# EAGLE design 2PLUS Osc Breakout Euro (EAGLE 7.7.0)
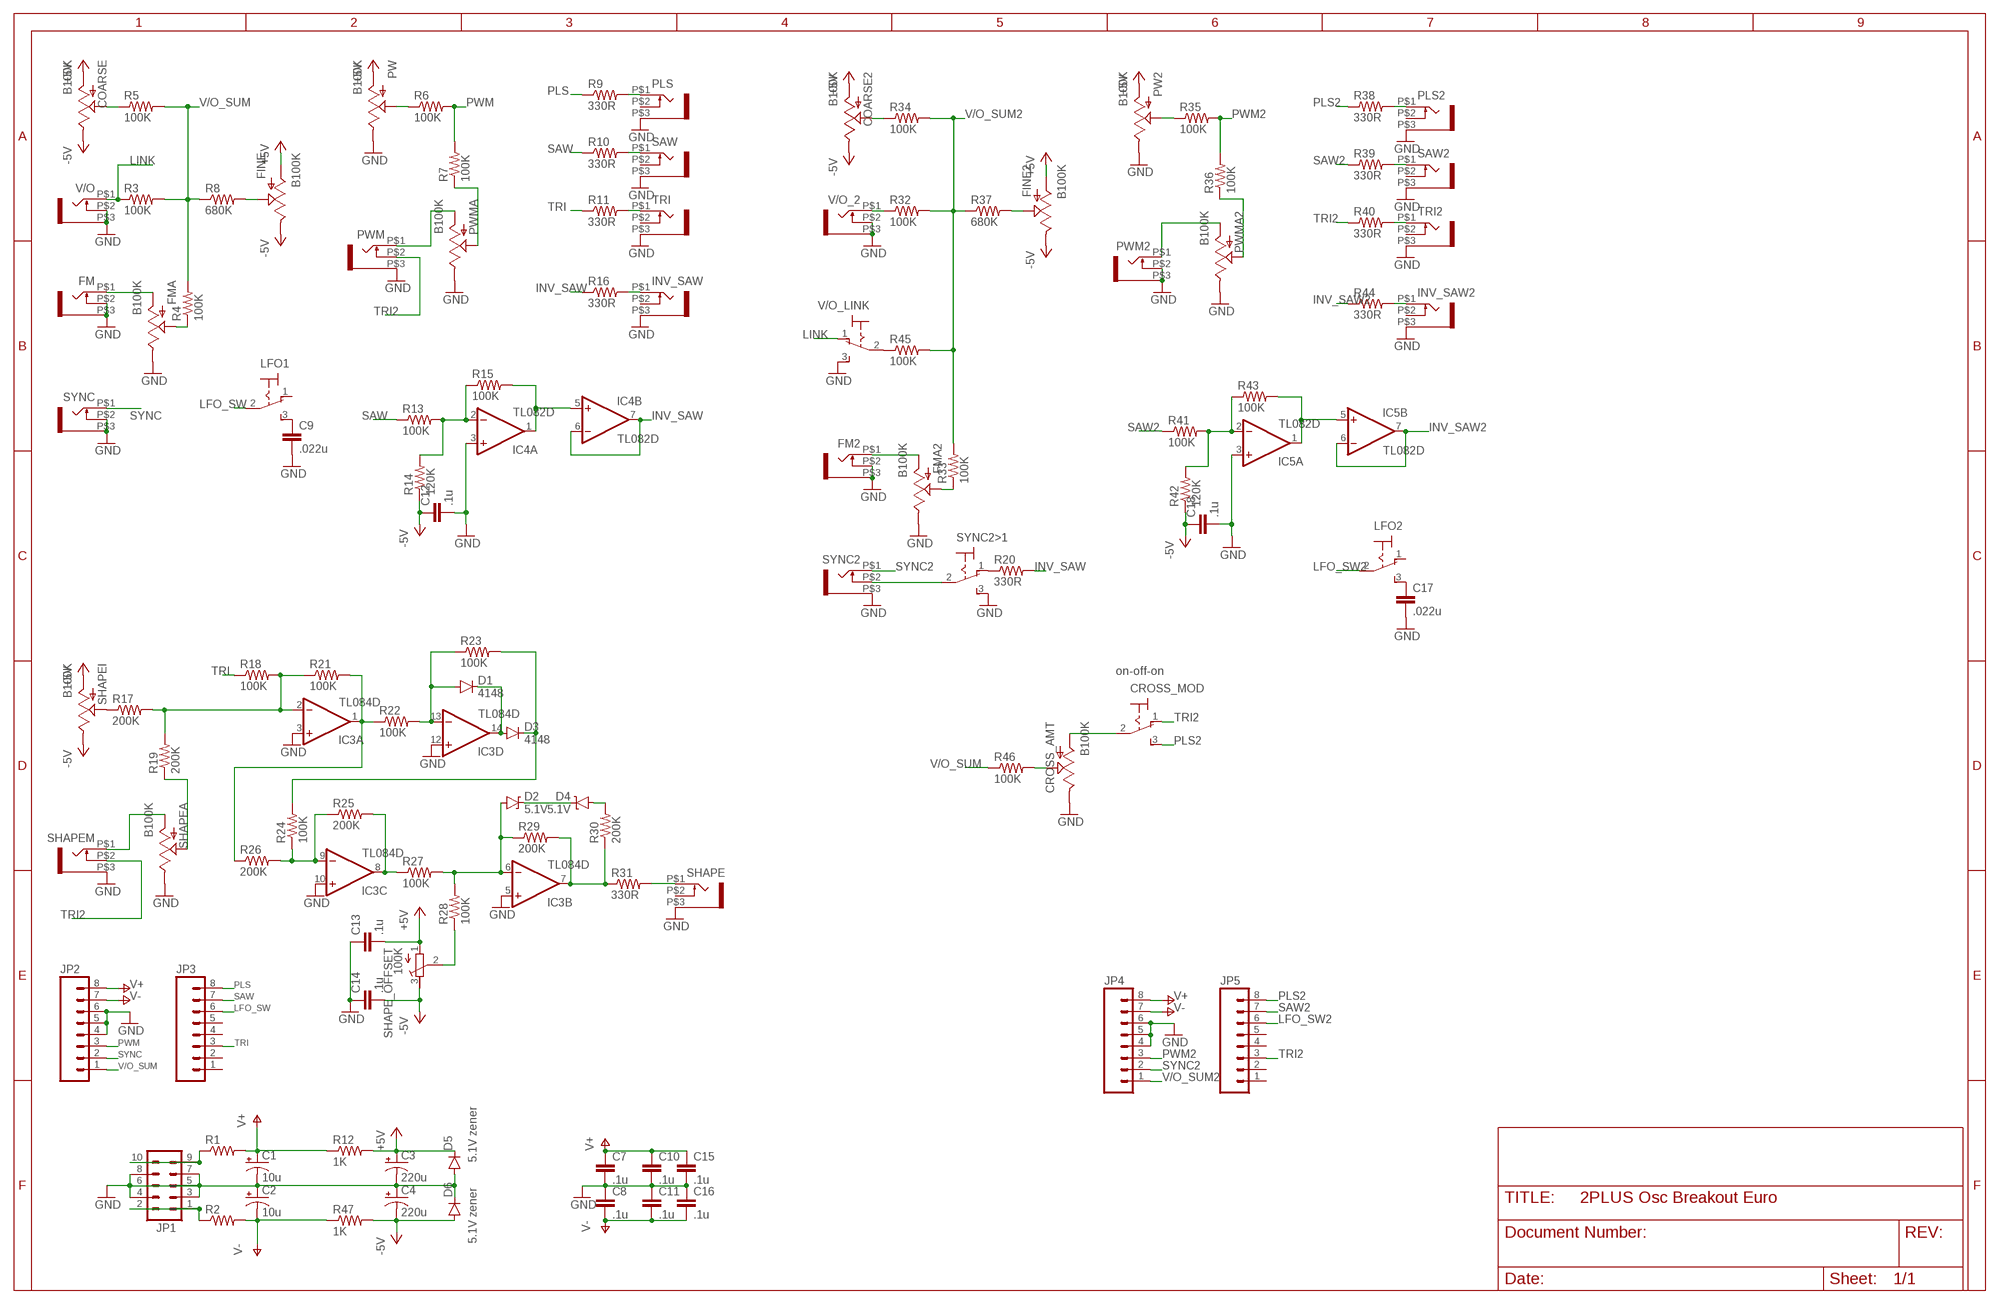
[diagram p0: schematic, sheet 1]

## Parts
C1  10u  CAP_POLC  [PANASONIC_C]
C2  10u  CAP_POLC  [PANASONIC_C]
C3  220u  CPOL-USE2.5-5  [E2,5-5]
C4  220u  CPOL-USE2.5-5  [E2,5-5]
C7  .1u  CAP0805  [0805]
C8  .1u  CAP0805  [0805]
C9  .022u  CAP0805  [0805]
C10  .1u  CAP0805  [0805]
C11  .1u  CAP0805  [0805]
C12  .1u  CAP0805  [0805]
C13  .1u  CAP0805  [0805]
C14  .1u  CAP0805  [0805]
C15  .1u  CAP0805  [0805]
C16  .1u  CAP0805  [0805]
C17  .022u  CAP0805  [0805]
C18  .1u  CAP0805  [0805]
COARSE  B100K  POT  [ALPS_POT]
COARSE2  B100K  POT  [ALPS_POT]
CROSS_AMT  B100K  POT  [ALPS_POT]
CROSS_MOD  M9040P  [M9040P]
D1  4148  DIODESOD123  [SOD-123]
D2  5.1V  DIODE-ZENER16V  [SOD-123]
D3  4148  DIODESOD123  [SOD-123]
D4  5.1V  DIODE-ZENER16V  [SOD-123]
D5  5.1V zener  DIODESOD123  [SOD-123]
D6  5.1V zener  DIODESOD123  [SOD-123]
FINE  B100K  POT  [ALPS_POT]
FINE2  B100K  POT  [ALPS_POT]
FM  WQP-PJ301M-12_JACK  [WQP-PJ301M-12_JACK]
FM2  WQP-PJ301M-12_JACK  [WQP-PJ301M-12_JACK]
FMA  B100K  POT  [ALPS_POT]
FMA2  B100K  POT  [ALPS_POT]
IC3  TL084D  [SO14]
IC4  TL082D  [SO08]
IC5  TL082D  [SO08]
INV_SAW  WQP-PJ301M-12_JACK  [WQP-PJ301M-12_JACK]
INV_SAW2  WQP-PJ301M-12_JACK  [WQP-PJ301M-12_JACK]
JP1  M05X2PTH  [AVR_ICSP]
JP2  M08  [1X08_ROUND]
JP3  M08  [1X08_ROUND]
JP4  M08  [1X08_ROUND]
JP5  M08  [1X08_ROUND]
LFO1  M9040P  [M9040P]
LFO2  M9040P  [M9040P]
PLS  WQP-PJ301M-12_JACK  [WQP-PJ301M-12_JACK]
PLS2  WQP-PJ301M-12_JACK  [WQP-PJ301M-12_JACK]
PW  B100K  POT  [ALPS_POT]
PW2  B100K  POT  [ALPS_POT]
PWM  WQP-PJ301M-12_JACK  [WQP-PJ301M-12_JACK]
PWM2  WQP-PJ301M-12_JACK  [WQP-PJ301M-12_JACK]
PWMA  B100K  POT  [ALPS_POT]
PWMA2  B100K  POT  [ALPS_POT]
R1  RESISTOR0805-RES  [0805]
R2  RESISTOR0805-RES  [0805]
R3  100K  RESISTOR0805-RES  [0805]
R4  100K  RESISTOR0805-RES  [0805]
R5  100K  RESISTOR0805-RES  [0805]
R6  100K  RESISTOR0805-RES  [0805]
R7  100K  RESISTOR0805-RES  [0805]
R8  680K  RESISTOR0805-RES  [0805]
R9  330R  RESISTOR0805-RES  [0805]
R10  330R  RESISTOR0805-RES  [0805]
R11  330R  RESISTOR0805-RES  [0805]
R12  1K  RESISTOR0805-RES  [0805]
R13  100K  RESISTOR0805-RES  [0805]
R14  120K  RESISTOR0805-RES  [0805]
R15  100K  RESISTOR0805-RES  [0805]
R16  330R  RESISTOR0805-RES  [0805]
R17  200K  RESISTOR0805-RES  [0805]
R18  100K  RESISTOR0805-RES  [0805]
R19  200K  RESISTOR0805-RES  [0805]
R20  330R  RESISTOR0805-RES  [0805]
R21  100K  RESISTOR0805-RES  [0805]
R22  100K  RESISTOR0805-RES  [0805]
R23  100K  RESISTOR0805-RES  [0805]
R24  100K  RESISTOR0805-RES  [0805]
R25  200K  RESISTOR0805-RES  [0805]
R26  200K  RESISTOR0805-RES  [0805]
R27  100K  RESISTOR0805-RES  [0805]
R28  100K  RESISTOR0805-RES  [0805]
R29  200K  RESISTOR0805-RES  [0805]
R30  200K  RESISTOR0805-RES  [0805]
R31  330R  RESISTOR0805-RES  [0805]
R32  100K  RESISTOR0805-RES  [0805]
R33  100K  RESISTOR0805-RES  [0805]
R34  100K  RESISTOR0805-RES  [0805]
R35  100K  RESISTOR0805-RES  [0805]
R36  100K  RESISTOR0805-RES  [0805]
R37  680K  RESISTOR0805-RES  [0805]
R38  330R  RESISTOR0805-RES  [0805]
R39  330R  RESISTOR0805-RES  [0805]
R40  330R  RESISTOR0805-RES  [0805]
R41  100K  RESISTOR0805-RES  [0805]
R42  120K  RESISTOR0805-RES  [0805]
R43  100K  RESISTOR0805-RES  [0805]
R44  330R  RESISTOR0805-RES  [0805]
R45  100K  RESISTOR0805-RES  [0805]
R46  100K  RESISTOR0805-RES  [0805]
R47  1K  RESISTOR0805-RES  [0805]
SAW  WQP-PJ301M-12_JACK  [WQP-PJ301M-12_JACK]
SAW2  WQP-PJ301M-12_JACK  [WQP-PJ301M-12_JACK]
SHAPE  WQP-PJ301M-12_JACK  [WQP-PJ301M-12_JACK]
SHAPE_OFFSET  100K  R-TRIMM3296Y  [RTRIM3296Y]
SHAPEA  B100K  POT  [ALPS_POT]
SHAPEI  B100K  POT  [ALPS_POT]
SHAPEM  WQP-PJ301M-12_JACK  [WQP-PJ301M-12_JACK]
SYNC  WQP-PJ301M-12_JACK  [WQP-PJ301M-12_JACK]
SYNC2  WQP-PJ301M-12_JACK  [WQP-PJ301M-12_JACK]
SYNC2>1  M9040P  [M9040P]
TRI  WQP-PJ301M-12_JACK  [WQP-PJ301M-12_JACK]
TRI2  WQP-PJ301M-12_JACK  [WQP-PJ301M-12_JACK]
V/O  WQP-PJ301M-12_JACK  [WQP-PJ301M-12_JACK]
V/O_2  WQP-PJ301M-12_JACK  [WQP-PJ301M-12_JACK]
V/O_LINK  M9040P  [M9040P]

## Nets
+5V: C3.+ C13.2 COARSE2.P$3(A) COARSE.P$3(A) D5.C FINE2.P$3(A) FINE.P$3(A) PW2.P$3(A) PW.P$3(A) R12.2 SHAPE_OFFSET.1(A) SHAPEI.P$3(A)
-5V: C4.- C12.1 C14.2 C18.1 COARSE2.P$1(E) COARSE.P$1(E) D6.A FINE2.P$1(E) FINE.P$1(E) R14.1 R42.1 R47.2 SHAPE_OFFSET.3(E) SHAPEI.P$1(E)
GND: C1.- C2.+ C3.- C4.+ C7.2 C8.1 C9.2 C10.2 C11.1 C12.2 C13.1 C14.1 C15.2 C16.1 C17.2 C18.2 CROSS_AMT.P$1(E) D5.A D6.C FM2.P$2 FM2.P$3 FM.P$2 FM.P$3 FMA2.P$1(E) FMA.P$1(E) IC3.3(A:+IN) IC3.5(B:+IN) IC3.10(C:+IN) IC3.12(D:+IN) IC4.3(A:+IN) IC5.3(A:+IN) INV_SAW2.P$3 INV_SAW.P$3 JP1.3 JP1.4 JP1.5 JP1.6 JP1.7 JP1.8 JP2.4 JP2.5 JP2.6 JP4.4 JP4.5 JP4.6 PLS2.P$3 PLS.P$3 PW2.P$1(E) PW.P$1(E) PWM2.P$2 PWM2.P$3 PWM.P$3 PWMA2.P$1(E) PWMA.P$1(E) SAW2.P$3 SAW.P$3 SHAPE.P$3 SHAPEA.P$1(E) SHAPEM.P$3 SYNC2.P$3 SYNC2>1.3(S) SYNC.P$2 SYNC.P$3 TRI2.P$3 TRI.P$3 V/O.P$2 V/O.P$3 V/O_2.P$2 V/O_2.P$3 V/O_LINK.3(S)
INV_SAW: IC4.6(B:-IN) IC4.7(B:OUT) R16.1 R20.2
INV_SAW2: IC5.6(B:-IN) IC5.7(B:OUT) R44.1
LFO_SW: JP3.6 LFO1.2(P)
LFO_SW2: JP5.6 LFO2.2(P)
LINK: R3.1 V/O.P$1 V/O_LINK.1(O)
N$1: JP1.9 JP1.10 R1.1
N$2: JP1.1 JP1.2 R2.1
N$3: FM.P$1 FMA.P$3(A)
N$4: COARSE.P$2(S) R5.1
N$5: R45.1 V/O_LINK.2(P)
N$6: FMA.P$2(S) R4.1
N$7: PW.P$2(S) R6.1
N$8: PWM.P$1 PWMA.P$3(A)
N$9: FINE.P$2(S) R8.2
N$10: C9.1 LFO1.3(S)
N$11: PWMA.P$2(S) R7.1
N$12: PLS.P$1 R9.2
N$13: R10.2 SAW.P$1
N$14: R11.2 TRI.P$1
N$15: IC4.2(A:-IN) R13.2 R14.2 R15.1
N$16: IC3.2(A:-IN) R17.2 R18.2 R19.2 R21.1
N$17: IC4.1(A:OUT) IC4.5(B:+IN) R15.2
N$18: CROSS_AMT.P$2(S) R46.2
N$19: INV_SAW.P$1 R16.2
N$20: R17.1 SHAPEI.P$2(S)
N$21: SHAPEA.P$3(A) SHAPEM.P$1
N$22: R19.1 SHAPEA.P$2(S)
N$23: SYNC2.P$2 SYNC2>1.2(P)
N$24: IC3.1(A:OUT) R21.2 R22.1 R26.1
N$25: D1.C D3.A IC3.14(D:OUT)
N$26: D1.A IC3.13(D:-IN) R22.2 R23.1
N$27: D3.C R23.2 R24.2
N$28: IC3.9(C:-IN) R24.1 R25.1 R26.2
N$29: IC3.8(C:OUT) R25.2 R27.1
N$30: D2.A IC3.6(B:-IN) R27.2 R28.2 R29.1
N$31: R28.1 SHAPE_OFFSET.2(S)
N$32: D2.C D4.C
N$33: D4.A R30.2
N$34: IC3.7(B:OUT) R29.2 R30.1 R31.1
N$35: R31.2 SHAPE.P$1
N$36: COARSE2.P$2(S) R34.1
N$37: R32.1 V/O_2.P$1
N$38: CROSS_AMT.P$3(A) CROSS_MOD.2(P)
N$39: FMA2.P$2(S) R33.1
N$40: C17.1 LFO2.3(S)
N$41: PW2.P$2(S) R35.1
N$42: FINE2.P$2(S) R37.2
N$43: PLS2.P$1 R38.2
N$44: R39.2 SAW2.P$1
N$45: R40.2 TRI2.P$1
N$46: FM2.P$1 FMA2.P$3(A)
N$47: PWM2.P$1 PWMA2.P$3(A)
N$48: INV_SAW2.P$1 R44.2
N$49: PWMA2.P$2(S) R36.1
N$50: R20.1 SYNC2>1.1(O)
N$61: IC5.2(A:-IN) R41.2 R42.2 R43.1
N$62: IC5.1(A:OUT) IC5.5(B:+IN) R43.2
PLS: JP3.8 R9.1
PLS2: CROSS_MOD.3(S) JP5.8 R38.1
PWM: JP2.3 R6.2 R7.2
PWM2: JP4.3 R35.2 R36.2
SAW: JP3.7 R10.1 R13.1
SAW2: JP5.7 R39.1 R41.1
SYNC: JP2.2 SYNC.P$1
SYNC2: JP4.2 SYNC2.P$1
TRI: JP3.3 R11.1 R18.1
TRI2: CROSS_MOD.1(O) JP5.3 PWM.P$2 R40.1 SHAPEM.P$2
V+: C1.+ C7.1 C10.1 C15.1 JP2.8 JP4.8 R1.2 R12.1
V-: C2.- C8.2 C11.2 C16.2 JP2.7 JP4.7 R2.2 R47.1
V/O_SUM: JP2.1 R3.2 R4.2 R5.2 R8.1 R46.1
V/O_SUM2: JP4.1 R32.2 R33.2 R34.2 R37.1 R45.2
Unconnected: INV_SAW2.P$2 INV_SAW.P$2 JP3.1 JP3.2 JP3.4 JP3.5 JP5.1 JP5.2 JP5.4 JP5.5 LFO1.1(O) LFO2.1(O) PLS2.P$2 PLS.P$2 SAW2.P$2 SAW.P$2 SHAPE.P$2 TRI2.P$2 TRI.P$2

## Notes on the sheet
- on-off-on

## Power pins joined to a net without a drawn wire
V+: IC3.4(P:V+) IC4.8(P:V+) IC5.8(P:V+)
V-: IC3.11(P:V-) IC4.4(P:V-) IC5.4(P:V-)

## Library data of the parts
C1 C2 = SparkFun-Capacitors:CAP_POL: Capacitor Polarized These are standard SMD and PTH capacitors. Normally 10uF, 47uF, and 100uF in electrolytic and tantalum varieties. Always verify the external diameter of the through hole cap, it varies with capacity, voltage, and manufacturer. The EIA devices should be standard.
C3 C4 = rcl:CPOL-US: POLARIZED CAPACITOR, American symbol
C7-C18 = SparkFun-Capacitors:CAP: Capacitor Standard 0603 ceramic capacitor, and 0.1" leaded capacitor.
COARSE COARSE2 CROSS_AMT FINE FINE2 FMA FMA2 PW PW2 PWMA PWMA2 SHAPEA SHAPEI = SparkFun-Electromechanical:POT; PROD_ID: RES-09177
CROSS_MOD LFO1 LFO2 SYNC2>1 V/O_LINK = switch:M9040P: TOGGLE SWITCH Marquardt
D1 D3 D5 D6 = SparkFun-DiscreteSemi:DIODE: Diode These are standard reverse protection diodes and small signal diodes. SMA package can handle up to about 1A. SOD-323 can handle about 200mA. What the SOD-323 package when ordering, there are some mfgs out there that are 5-pin packages.
D2 D4 = SparkFun-DiscreteSemi:DIODE-ZENER: Zener Diode Production Part - 8199 3.4V Zener Voltage; PROD_ID: DIO-12440; VALUE: 16V
FM FM2 INV_SAW INV_SAW2 PLS PLS2 PWM PWM2 SAW SAW2 SHAPE SHAPEM SYNC SYNC2 TRI TRI2 V/O V/O_2 = thonkiconn:WQP-PJ301M-12_JACK
IC3 = linear:TL084: OP AMP
IC4 IC5 = linear:TL082: OP AMP Data sheet <http://www.ti.com/lit/ds/symlink/tl084a . pdf>; DATA_SHEET: <a href="http://www.ti.com/lit/ds/symlink/tl084a.pdf"> Data sheet </a>
JP1 = SparkFun-Connectors:M05X2: Header 5x2 Standard 10-pin dual row 0.1" header. Commonly used with AVR-ISP. Use with Spark Fun Electronics SKU: PRT-00778
JP2-JP5 = SparkFun-Connectors:M08: Header 8 Standard 8-pin 0.1" header. Use with straight break away headers (SKU : PRT-00116), right angle break away headers (PRT-00553), swiss pins (PRT-00743), machine pins (PRT-00117), and female headers (PRT-00115).
R1-R47 = SparkFun-Passives:RESISTOR: Resistor Basic schematic elements and footprints for 0603, 1206, and PTH resistors.
SHAPE_OFFSET = rcl:R-TRIMM: Trimm resistor

## Board
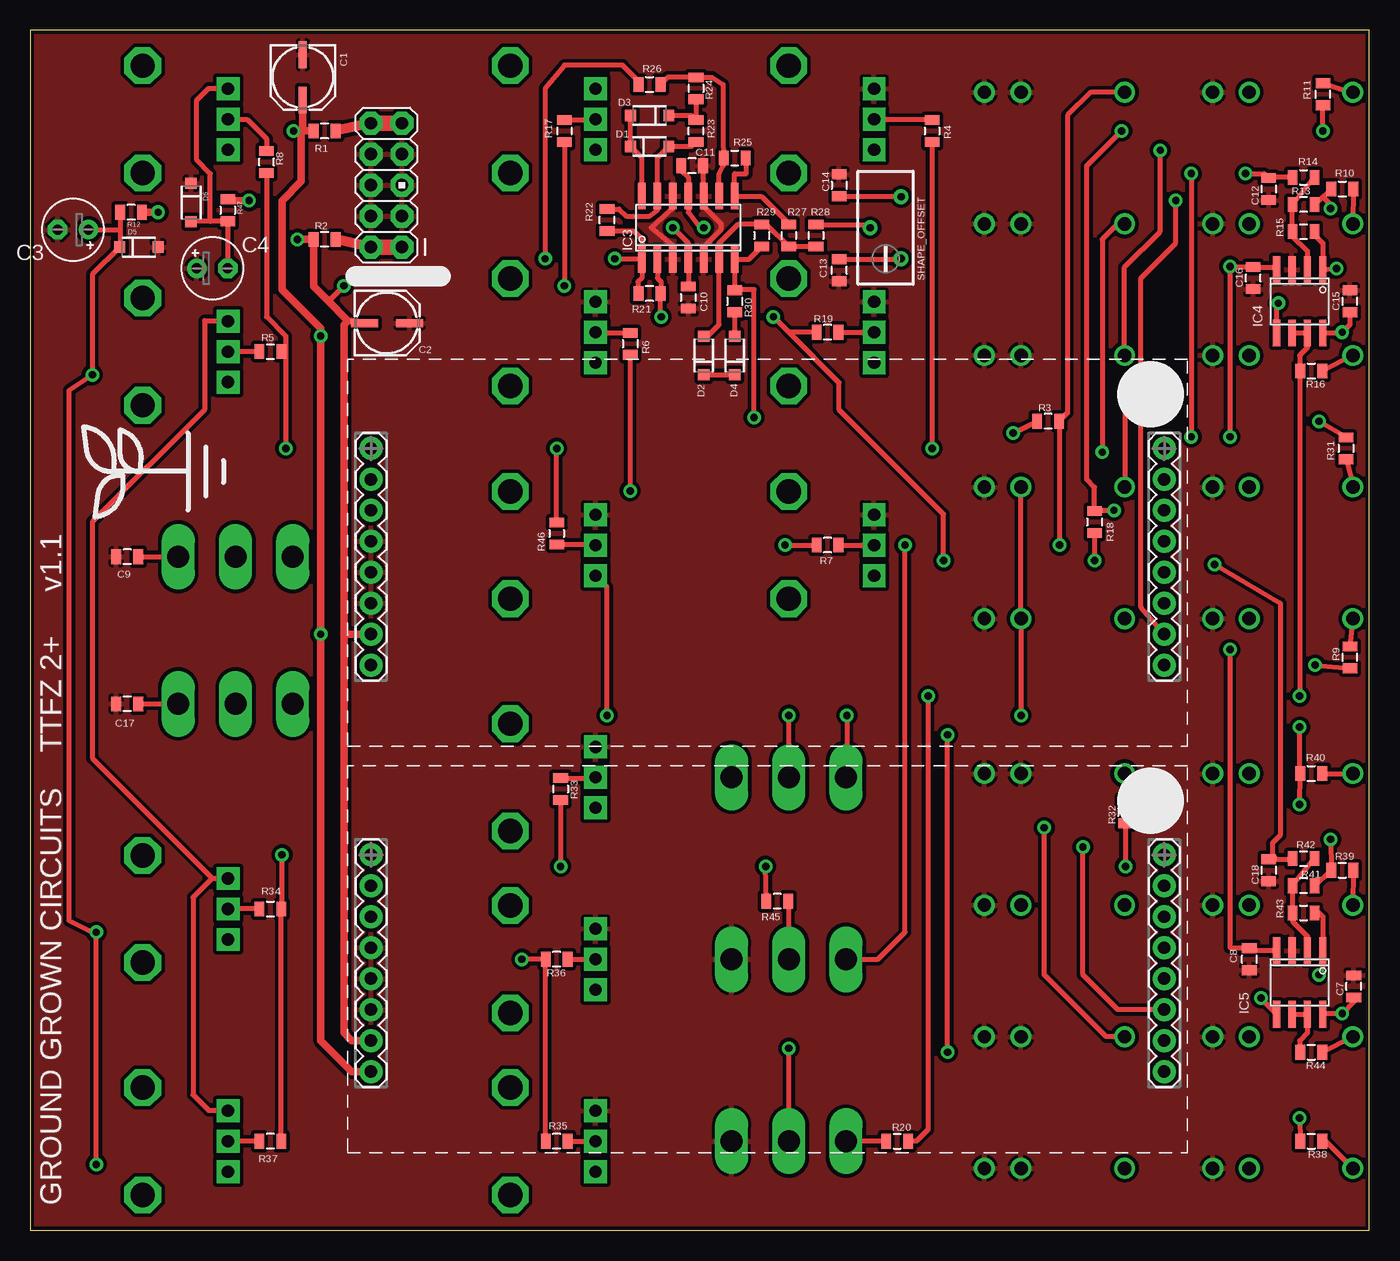
[diagram p1: board, top side]
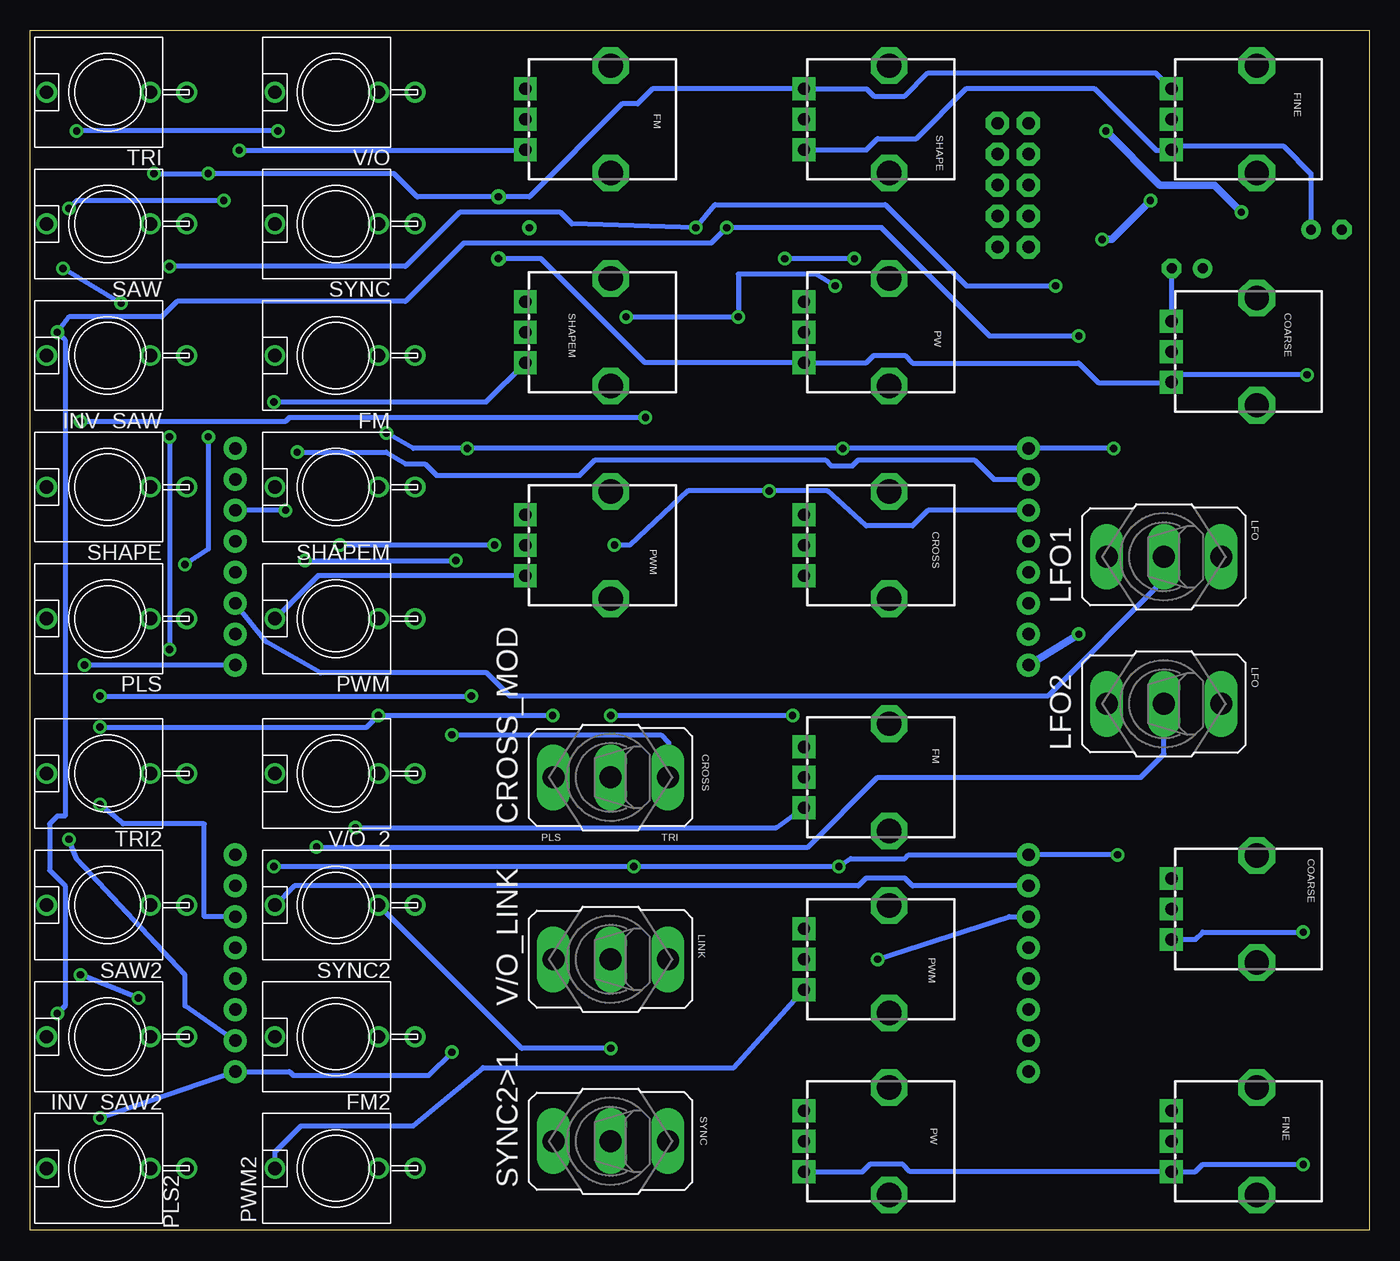
[diagram p2: board, bottom side, seen from below]

Size 109.83 x 98.41 mm. Coordinates in mm from the lower left corner, seen from the top.
Outline: 0,0 109.83,0 109.83,98.41 0,98.41 0,0
Copper layers (1*16): Top 0.035mm / dielectric 1.5mm / Bottom 0.035mm
Design rules "SparkFun": minimum track width 8mil, minimum drill 20mil, track to track 8mil, track to pad 8mil, pad to pad 8mil, via to via 8mil, smd to smd 8mil, copper to edge 8mil, drill to drill 8mil, minimum pad ring 12mil, minimum via ring 10mil, stop-mask expansion 4mil, vias tented up to drill 20mil, thermal gap 10mil

### Footprints (pad centres in the part's own frame; a part is rotated, then mirrored left to right if it is on the bottom)
PANASONIC_C = smd 2.2 x 0.65: + 1.9,-0.2; - -1.8,-0.2
E2,5-5 = drill 0.813 pad 1.6: + -1.27,0 | drill 0.813 pad 1.6 octagon: - 1.27,0
0805 = smd 0.8 x 1.2: 1 -0.9,0; 2 0.9,0
ALPS_POT = drill 1 pad 1.88 square: P$1 7,-2.5; P$2 7,0; P$3 7,2.5 | drill 2 octagon: P$4 0,-4.4; P$5 0,4.4
M9040P = drill 1.803 long: 1 0,4.699; 2 0,0; 3 0,-4.699
SOD-123 = smd 0.9 x 0.95: A 1.575,0; C -1.575,0
WQP-PJ301M-12_JACK = drill 1.1: P$1 0,5; P$2 0,-3.5; P$3 0,-6.5
SO14 = smd 0.6 x 2.2: 1 -3.81,-2.6; 2 -2.54,-2.6; 3 -1.27,-2.6; 4 0,-2.6; 5 1.27,-2.6; 6 2.54,-2.6; 7 3.81,-2.6; 8 3.81,2.6; 9 2.54,2.6; 10 1.27,2.6; 11 0,2.6; 12 -1.27,2.6; 13 -2.54,2.6; 14 -3.81,2.6
SO08 = smd 0.6 x 2.2: 1 -1.905,-2.6; 2 -0.635,-2.6; 3 0.635,-2.6; 4 1.905,-2.6; 5 1.905,2.6; 6 0.635,2.6; 7 -0.635,2.6; 8 -1.905,2.6
AVR_ICSP = drill 1.016 pad 1.88 octagon: 1 -1.27,5.08; 2 1.27,5.08; 3 -1.27,2.54; 4 1.27,2.54; 5 -1.27,0; 6 1.27,0; 7 -1.27,-2.54; 8 1.27,-2.54; 9 -1.27,-5.08; 10 1.27,-5.08
1X08_ROUND = drill 1.016 pad 1.88: 1 0,0; 2 2.54,0; 3 5.08,0; 4 7.62,0; 5 10.16,0; 6 12.7,0; 7 15.24,0; 8 17.78,0
RTRIM3296Y = drill 0.61: 1 1.27,-2.54; 2 -1.27,0; 3 1.27,2.54

### Placement (x,y rotation side)
C1  22.54,94.61 270 top
C2  29.21,74.61 0 top
C3  3.49,82.07 180 top
C4  14.92,78.9 0 top
C7  108.58,20 90 top
C8  100.01,22.23 90 top
C9  7.94,55.24 180 top
C10  53.98,76.52 270 top
C11  54.29,87.31 180 top
C12  101.6,85.41 270 top
C13  66.36,78.74 90 top
C14  66.36,85.72 270 top
C15  108.27,76.2 90 top
C16  100.33,78.11 90 top
C17  7.94,43.18 180 top
C18  101.6,29.53 270 top
COARSE  9.21,72.07 180 bottom
COARSE2  9.21,26.35 180 bottom
CROSS_AMT  39.37,56.2 180 bottom
CROSS_MOD  62.23,37.15 90 bottom
D1  50.8,88.9 0 top
D2  55.24,71.75 90 top
D3  50.8,91.44 180 top
D4  57.78,71.75 90 top
D5  8.89,80.64 0 top
D6  13.18,84.3 270 top
FINE  9.21,91.12 180 bottom
FINE2  9.21,7.3 180 bottom
FM  84.77,71.75 90 bottom
FM2  84.77,15.88 90 bottom
FMA  62.23,91.12 180 bottom
FMA2  39.37,37.15 180 bottom
IC3  53.98,82.23 0 top
IC4  104.14,76.2 180 top
IC5  104.14,20.32 180 top
INV_SAW  103.5,71.75 90 bottom
INV_SAW2  103.5,15.88 90 bottom
JP1  29.21,85.72 180 top
JP2  27.94,64.14 270 top
JP3  93.03,64.14 270 top
JP4  27.94,30.8 270 top
JP5  93.03,30.8 270 top
LFO1  16.83,55.24 90 bottom
LFO2  16.83,43.18 90 bottom
PLS  103.5,50.16 90 bottom
PLS2  103.5,5.08 90 bottom
PW  39.37,73.66 180 bottom
PW2  39.37,7.3 180 bottom
PWM  84.77,50.16 90 bottom
PWM2  84.77,5.08 90 bottom
PWMA  62.23,56.2 180 bottom
PWMA2  39.37,22.23 180 bottom
R1  24.13,90.17 180 top
R2  24.13,81.28 180 top
R3  83.5,66.36 180 top
R4  73.98,90.17 270 top
R5  19.68,72.07 0 top
R6  49.21,72.71 270 top
R7  65.41,56.2 180 top
R8  19.37,87.63 90 top
R9  108.27,46.99 90 top
R10  107.63,85.41 0 top
R11  106.05,93.19 90 top
R12  8.26,83.5 180 top
R13  104.46,84.14 180 top
R14  104.46,86.36 0 top
R15  104.46,81.92 0 top
R16  105.09,70.48 0 top
R17  43.81,90.17 270 top
R18  87.31,58.1 270 top
R19  65.41,73.66 180 top
R20  71.12,7.3 0 top
R21  50.8,76.83 180 top
R22  47.31,82.87 90 top
R23  54.61,90.17 90 top
R24  54.61,93.66 270 top
R25  57.78,87.95 0 top
R26  50.8,93.98 0 top
R27  62.23,81.6 270 top
R28  64.45,81.6 270 top
R29  60.01,81.6 270 top
R30  57.78,76.2 270 top
R31  107.95,64.14 270 top
R32  89.85,34.29 270 top
R33  43.5,36.2 270 top
R34  19.68,26.35 0 top
R35  43.18,7.3 180 top
R36  43.18,22.23 180 top
R37  19.68,7.3 180 top
R38  105.09,7.3 0 top
R39  107.63,29.53 0 top
R40  105.09,37.47 0 top
R41  104.46,28.26 180 top
R42  104.46,30.48 0 top
R43  104.46,26.04 0 top
R44  105.09,14.61 0 top
R45  61.28,26.99 180 top
R46  43.18,57.15 270 top
R47  16.19,83.66 270 top
SAW  103.5,82.55 90 bottom
SAW2  103.5,26.67 90 bottom
SHAPE  103.5,60.96 90 bottom
SHAPE_OFFSET  70.17,82.23 0 top
SHAPEA  62.23,73.66 180 bottom
SHAPEI  39.37,91.12 180 bottom
SHAPEM  84.77,60.96 90 bottom
SYNC  84.77,82.55 90 bottom
SYNC2  84.77,26.67 90 bottom
SYNC2>1  62.23,7.3 90 bottom
TRI  103.5,93.34 90 bottom
TRI2  103.5,37.47 90 bottom
U$1  [OSC_CORE_OUTLINE]  26.04,39.69 0 top
U$2  [OSC_CORE_OUTLINE]  26.04,6.35 0 top
U$3  [LOGO_MED]  12.86,62.23 90 top
V/O  84.77,93.34 90 bottom
V/O_2  84.77,37.47 90 bottom
V/O_LINK  62.23,22.23 90 bottom

### Tracks (layer width: path | path; a pad name or v marks a point on that pad's centre or on a via)
+5V  (via drill 0.6)
  Top 0.406: v5.4,5.4 v5.4,24.45 5.08,24.45 3.17,25.4 3.17,68.9 v5.08,70.17 5.08,78.41 D5.C 7.36,80.69 7.36,82.07 | C13.2 71.39,79.64 SHAPE_OFFSET.1 | R12.2 7.36,82.07 | C3.+ 7.36,82.07
  Bottom 0.406: v5.08,70.17 15.61,70.17 COARSE.P$3 16.25,69.53 22.23,69.53 23.81,71.12 37.47,71.12 38.1,71.75 40.64,71.75 41.23,71.16 PW.P$3 59.41,71.16 67.94,79.69 SHAPE_OFFSET.1 | COARSE2.P$3 14.25,23.85 13.65,24.45 v5.4,24.45 | v5.4,5.4 13.65,5.4 14.25,4.8 FINE2.P$3 37.66,4.8 38.26,5.4 40.96,5.4 41.59,4.76 46.65,4.76 PW2.P$3 | SHAPEI.P$3 41.23,88.62 40.32,89.53 37.15,89.53 33.02,93.66 22.54,93.66 17.46,88.58 16.25,88.58 FINE.P$3 15.93,88.9 6.99,88.9 4.76,86.68 C3.+
-5V  (via drill 0.6)
  Top 0.406: FINE.P$1 16.17,93.66 14.61,93.66 13.65,92.71 13.65,87.79 14.76,86.68 14.76,82.76 | 14.29,74.61 16.17,74.61 COARSE.P$1 14.33,74.57 14.29,74.61 | 14.29,74.61 14.29,67.31 5.08,58.1 5.08,38.73 14.92,28.89 16.17,28.89 COARSE2.P$1 14.88,28.85 13.34,27.3 13.34,11.11 14.61,9.84 16.17,9.84 FINE2.P$1 | C18.1 102.23,30.43 | 102.23,30.43 103.5,30.43 R42.1 | C14.2 71.39,84.83 SHAPE_OFFSET.3 | v99.69,86.68 101.23,86.68 C12.1 101.65,86.36 R14.1 | v95.25,86.68 v95.25,65.09 | v97.16,54.61 102.55,51.44 102.55,32.38 101.92,31.75 101.92,30.75 102.23,30.43 | C4.- R47.2 14.76,82.76 | 14.76,82.76 13.22,82.76 D6.A
  Bottom 0.406: FINE.P$1 17.52,94.93 36.2,94.93 38.1,93.03 40.64,93.03 41.23,93.62 SHAPEI.P$1 58.78,93.62 60.01,92.39 61.28,92.39 68.9,84.77 SHAPE_OFFSET.3 78.11,84.77 80.01,86.68 v95.25,86.68 v99.69,86.68 | v95.25,65.09 95.25,55.88 v97.16,54.61 | C4.- 16.17,78.87 16.21,78.83 COARSE.P$1
GND
  Top 0.406: C11.1 55.19,84.89 | 55.19,84.89 IC3.10 | 55.19,84.89 55.19,84.03 56.67,82.55 56.67,82.07 55.24,80.64 IC3.5 | IC3.12 52.7,83.82 50.96,82.23 52.7,80.8 IC3.3
  pour Top (isolate 0.305): 0,0 0,98.42 109.86,98.42 109.86,0
INV_SAW  (via drill 0.6)
  Top 0.406: IC4.6 IC4.7 104.78,72.39 104.14,71.75 104.14,70.54 R16.1 104.14,70.48 v104.14,43.81 | v73.66,43.81 73.66,8.26 72.71,7.3 R20.2
  Bottom 0.406: v104.14,43.81 v73.66,43.81
INV_SAW2
  Top 0.406: IC5.6 IC5.7 104.78,16.19 104.14,15.56 104.14,14.66 R44.1
LFO_SW
  Bottom 0.406: LFO1.2 16.83,53.34 26.35,43.81 70.48,43.81 72.39,45.72 86.04,45.72 90.49,48.26 JP3.6
LFO_SW2  (via drill 0.6)
  Top 0.406: JP5.6 89.22,18.1 86.36,20.95 v86.36,31.43
  Bottom 0.406: v86.36,31.43 46.04,31.43 40.32,37.15 18.73,37.15 16.83,39.05 LFO2.2
LINK  (via drill 0.6)
  Top 0.406: V/O.P$1 87,93.34 85.09,91.44 85.09,67.05 R3.1 84.45,66.31 v84.45,56.2 | V/O_LINK.1 69.53,22.23 71.75,24.45 v71.75,56.2
  Bottom 0.406: v71.75,56.2 v84.45,56.2
N$1
  Top 0.813: JP1.10 R1.1
  Top 1.27: JP1.9 JP1.10
N$2
  Top 0.813: JP1.2 R2.1
  Top 1.27: JP1.2 JP1.1
N$3  (via drill 0.6)
  Top 0.406: FM.P$1 89.77,78.98 92.71,81.92 v92.71,88.58
  Bottom 0.406: v92.71,88.58 69.27,88.58 FMA.P$3
N$4
  Top 0.406: R5.1 COARSE.P$2
N$5
  Top 0.406: R45.1 V/O_LINK.2
N$6
  Top 0.406: R4.1 69.23,91.07 FMA.P$2
N$7
  Top 0.406: PW.P$2 46.32,73.61 R6.1
N$8
  Bottom 0.406: PWMA.P$3 86.24,53.7 PWM.P$1
N$9
  Top 0.406: FINE.P$2 17.78,91.12 19.37,89.53 R8.2
N$10
  Top 0.406: C9.1 LFO1.3
N$11
  Top 0.406: R7.1 PWMA.P$2
N$12
  Top 0.406: PLS.P$1 R9.2
N$13
  Top 0.406: R10.2 SAW.P$1
N$14
  Top 0.406: R11.2 108.45,93.29 TRI.P$1
N$15
  Top 0.406: IC4.2 104.78,80.33 103.56,81.55 R15.1 R13.2 R14.2
N$16  (via drill 0.6)
  Top 0.406: IC3.2 51.44,78.11 51.75,77.79 51.75,76.89 R21.1 51.7,74.93 v51.75,74.93 | R17.2 v43.81,77.47 | R19.2 62.23,73.66 | 62.23,73.66 62.07,73.82 v60.96,74.93 | R18.2 v87.31,54.93 | v74.93,54.93 74.93,58.74 66.36,67.31 66.36,69.53 62.23,73.66
  Bottom 0.406: v43.81,77.47 45.4,78.42 51.75,78.42 v51.75,74.93 v60.96,74.93 | v87.31,54.93 v74.93,54.93
N$17  (via drill 0.6)
  Top 0.406: R15.2 105.36,81.65 106.05,80.96 IC4.1 v107.16,78.9 | v102.39,76.04 102.23,75.88 IC4.5
  Bottom 0.406: v107.16,78.9 v102.39,76.04
N$18
  Top 0.406: R46.2 46.32,56.25 CROSS_AMT.P$2
N$19
  Top 0.406: R16.2 INV_SAW.P$1
N$20
  Top 0.406: R17.1 46.32,91.07 SHAPEI.P$2
N$21  (via drill 0.6)
  Top 0.406: SHAPEM.P$1 89.85,61.04 v89.85,67.94
  Bottom 0.406: v89.85,67.94 72.44,67.94 SHAPEA.P$3
N$22
  Top 0.406: R19.1 SHAPEA.P$2
N$23  (via drill 0.6)
  Top 0.406: SYNC2>1.2 v62.23,14.92
  Bottom 0.406: v62.23,14.92 69.53,14.92 SYNC2.P$2
N$24  (via drill 0.6)
  Top 0.406: R22.1 49.48,81.97 50.16,81.28 IC3.1 | IC3.1 50.16,78.11 49.85,77.79 49.85,76.89 R21.2 | R26.1 49.9,94.25 48.58,95.57 43.81,95.57 42.23,93.66 v42.23,79.69 | v47.94,79.69 50.1,79.69 IC3.1
  Bottom 0.406: v42.23,79.69 v47.94,79.69
N$25
  Top 0.406: IC3.14 50.16,87.96 D1.C D3.A
N$26
  Top 0.406: R23.1 54.24,88.9 D1.A 51.44,87.96 IC3.13 51.44,83.66 50.8,83.19 48.9,83.19 48.31,83.77 R22.2
N$27
  Top 0.406: D3.C 54.24,91.44 R23.2 R24.2
N$28
  Top 0.406: R26.2 52.28,94.56 R24.1 55.93,94.56 56.83,93.98 56.83,89.59 R25.1 56.83,87.89 56.83,87.31 56.52,86.68 IC3.9
N$29
  Top 0.406: R25.2 58.74,87.58 58.74,86.68 57.78,86.68 IC3.8 57.84,84.77 60.01,84.77 62.23,82.55 R27.1
N$30
  Top 0.406: R28.2 R27.2 60.43,82.5 R29.1 59.95,82.55 58.1,82.55 56.52,80.96 IC3.6 56.52,74.3 55.55,73.33 D2.A
N$31
  Top 0.406: R28.1 68.63,82.5 SHAPE_OFFSET.2
N$32
  Top 0.406: D2.C D4.C
N$33
  Top 0.406: R30.2 D4.A
N$34  (via drill 0.6)
  Top 0.406: R29.2 58.94,79.63 IC3.7 R30.1 57.84,77.15 59.37,77.15 v59.37,66.67 | R31.1 v105.73,66.36
  Bottom 0.406: v105.73,66.36 88.9,66.36 88.58,66.67 v59.37,66.67
N$35
  Top 0.406: R31.2 108.58,60.88 SHAPE.P$1
N$36
  Top 0.406: R34.1 COARSE2.P$2
N$37
  Top 0.406: R32.1 V/O_2.P$1
N$38  (via drill 0.6)
  Top 0.406: CROSS_MOD.2 v62.23,42.23 | v47.31,42.23 47.31,52.76 CROSS_AMT.P$3
  Bottom 0.406: v62.23,42.23 v47.31,42.23
N$39
  Top 0.406: R33.1 46.63,37.09 FMA2.P$2
N$40
  Top 0.406: C17.1 LFO2.3
N$41
  Top 0.406: R35.1 PW2.P$2
N$42
  Top 0.406: R37.2 FINE2.P$2
N$43
  Top 0.406: R38.2 106.28,7.3 PLS2.P$1
N$44
  Top 0.406: R39.2 SAW2.P$1
N$45
  Top 0.406: R40.2 TRI2.P$1
N$46  (via drill 0.6)
  Top 0.406: FM2.P$1 88.27,15.88 83.19,20.95 v83.19,33.02
  Bottom 0.406: v83.19,33.02 48.63,33.02 FMA2.P$3
N$47
  Bottom 0.406: PWM2.P$1 89.77,6.43 87.63,8.57 78.42,8.57 72.71,13.34 52.12,13.34 PWMA2.P$3
N$48
  Top 0.406: R44.2 INV_SAW2.P$1
N$49
  Top 0.406: R36.1 PWMA2.P$2
N$50
  Top 0.406: R20.1 SYNC2>1.1
N$61
  Top 0.406: IC5.2 104.78,24.13 103.56,25.35 R43.1 R41.2 R42.2
N$62  (via drill 0.6)
  Top 0.406: R43.2 105.73,26.04 106.05,25.72 IC5.1 106.05,21.59 v105.73,20.95 | IC5.5 102.23,17.78 v100.97,19.05
  Bottom 0.406: v100.97,19.05 v105.73,20.95
PLS  (via drill 0.6)
  Top 0.406: v105.41,46.35 R9.1
  Bottom 0.406: JP3.8 v105.41,46.35
PLS2  (via drill 0.6)
  Top 0.406: v104.14,9.21 R38.1 | v75.25,14.61 v75.25,40.64
  Bottom 0.406: v104.14,9.21 JP5.8 88.58,13.02 88.27,12.7 77.15,12.7 v75.25,14.61 | v75.25,40.64 58.1,40.64 57.47,40.01 57.47,37.21 CROSS_MOD.3
PWM  (via drill 0.6)
  Top 0.406: v61.91,56.2 R7.2 | R6.2 v49.21,60.64
  Bottom 0.406: JP2.3 36.2,59.05 37.47,57.78 41.27,57.78 44.45,60.64 v49.21,60.64 55.88,60.64 60.64,56.2 v61.91,56.2
PWM2  (via drill 0.6)
  Top 0.406: R35.2 R36.2 v40.32,22.23
  Bottom 0.406: v40.32,22.23 29.53,25.72 JP4.3
SAW  (via drill 0.6)
  Top 0.406: R13.1 106.03,84.76 | 106.03,84.76 R10.1 | JP3.7 91.12,51.12 91.12,78.11 93.98,80.96 v93.98,84.45 | v106.68,83.82 106.68,84.11 106.03,84.76
  Bottom 0.406: v93.98,84.45 106.05,84.45 v106.68,83.82
SAW2  (via drill 0.6)
  Top 0.406: R41.1 R39.1 v106.68,32.07
  Bottom 0.406: JP5.7 97.16,18.41 97.16,20.95 106.05,30.48 v106.68,32.07
SYNC  (via drill 0.6)
  Top 0.406: SYNC.P$1 89.22,82.55 87.95,81.28 v87.95,63.82
  Bottom 0.406: v87.95,63.82 80.64,63.82 79.06,62.87 77.47,62.87 76.52,61.91 64.77,61.91 63.5,63.18 44.61,63.18 44.13,62.71 42.39,62.71 41.91,63.18 32.38,63.18 30.8,61.59 JP2.2
SYNC2
  Bottom 0.406: JP4.2 37.47,28.26 38.1,28.89 41.27,28.89 41.91,28.26 88.19,28.26 SYNC2.P$1
TRI  (via drill 0.6)
  Top 0.406: v89.53,90.17 86.68,87.31 86.68,61.59 87.31,60.96 R18.1 87.36,59.05 v88.9,59.05 | v106.05,90.17 R11.1
  Bottom 0.406: v89.53,90.17 v106.05,90.17 | v88.9,59.05 JP3.3
TRI2  (via drill 0.6)
  Top 0.406: v104.14,34.92 R40.1 104.14,37.47 v104.14,41.27 | v66.99,42.23 66.99,37.21 CROSS_MOD.1 | v81.28,42.23 81.27,43.19 PWM.P$2 SHAPEM.P$2
  Bottom 0.406: JP5.3 95.57,25.72 95.57,33.34 102.23,33.34 v104.14,34.92 | v104.14,41.27 82.23,41.27 v81.28,42.23 v66.99,42.23
V+  (via drill 0.6)
  Top 0.406: C10.1 IC3.4 53.98,80.96 v52.7,82.23 | 106.11,73.66 IC4.8 107.57,73.6 v107.63,73.66 108.27,74.3 C15.1 | IC5.8 106.11,17.78 v107.63,17.78 108.58,18.73 C7.1
  Top 0.61: R1.2 22.23,90.17 | C1.+ 22.34,90.29 22.23,90.17 | v21.59,90.17 22.23,90.17 | JP4.8 26.35,13.02 23.81,15.56 v23.81,48.9 v23.81,73.34 23.81,73.98 20.64,77.15 20.64,84.45 22.23,86.04 22.23,90.17 | v10.48,83.5 R12.1
  Bottom 0.406: v23.81,73.34 31.11,73.34 40.01,82.23 v52.7,82.23 53.98,80.96 74.3,80.96 79.06,76.2 97.79,76.2 99.06,74.93 106.68,74.93 v107.63,73.66 107,73.03 107,33.97 107.63,33.97 108.27,33.34 108.27,29.53 107,28.26 107,18.41 v107.63,17.78
  Bottom 0.61: v21.59,90.17 17.14,85.72 12.7,85.72 v10.48,83.5 | v23.81,48.9 JP2.8
V-  (via drill 0.6)
  Top 0.406: IC5.4 100.12,22.92 C8.2 99.96,23.18 98.42,23.18 v98.42,47.62 | C16.2 102.03,79 IC4.4 | v55.24,82.23 54.93,82.23 53.98,83.5 IC3.11 53.98,86.36 53.39,86.94 C11.2 | v25.72,77.47 24.45,76.2 | 100.28,79.06 C16.2 | v98.42,65.09 v98.42,79.06 98.48,79 C16.2
  Top 0.61: v21.91,81.28 R2.2 23.23,77.42 24.45,76.2 26.04,74.61 | 26.04,74.61 C2.- | JP2.7 25.72,48.9 | 25.72,48.9 25.72,74.3 26.04,74.61 | JP4.7 26.35,15.56 25.72,16.19 25.72,48.9 | v17.94,84.45 16.3,84.45 R47.1
  Bottom 0.406: v25.72,77.47 33.02,77.47 39.69,84.14 53.66,84.14 v55.24,82.23 65.41,82.55 66.36,83.5 74.61,83.5 79.06,79.06 v98.42,79.06 | v98.42,65.09 v98.42,47.62
  Bottom 0.61: v21.91,81.28 21.11,81.28 v17.94,84.45
V/O_SUM  (via drill 0.6)
  Top 0.406: R8.1 19.37,74.93 20.95,73.34 20.95,72.07 | 20.95,72.07 v20.95,64.14 | R5.2 20.95,72.07 | v80.64,65.41 R3.2 | R46.1 v43.18,64.14 | R4.2 v73.98,64.14
  Bottom 0.406: v20.95,64.14 JP2.1 v43.18,64.14 v73.98,64.14 78.42,64.14 v80.64,65.41
V/O_SUM2  (via drill 0.6)
  Top 0.406: R32.2 v89.85,29.84 | R33.2 v43.5,29.84 | R45.2 v60.33,29.84 | R37.1 R34.2 20.64,26.35 v20.64,30.8
  Bottom 0.406: v89.85,29.84 v60.33,29.84 v43.5,29.84 42.55,30.48 38.1,30.48 37.78,30.8 JP4.1 v20.64,30.8

### Text on the board
tPlace: v1.1 | TTFZ 2+ | GROUND GROWN CIRCUITS
bPlace: FINE | FM | SHAPE | COARSE | SHAPEM | PW | LFO | CROSS | PWM | LFO | FM | CROSS | TRI | PLS | COARSE | LINK | PWM | FINE | SYNC | PW